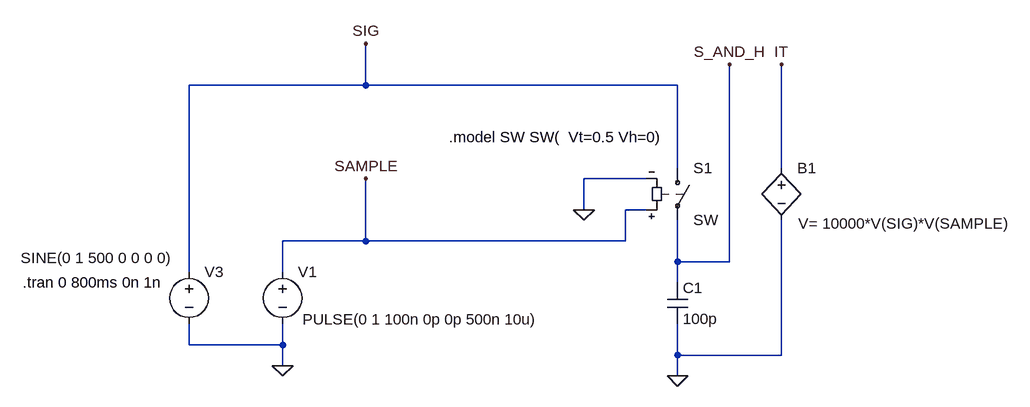
[diagram p0: schematic sampling.asc]
sampling.asc, the LTspice schematic file:
Version 4
SHEET 1 1884 680
WIRE 208 -176 208 -240
WIRE 208 -176 -64 -176
WIRE 688 -176 208 -176
WIRE 688 -48 688 -176
WIRE 848 -48 848 -208
WIRE 640 -32 544 -32
WIRE 544 16 544 -32
WIRE 640 16 608 16
WIRE 208 64 208 -32
WIRE 208 64 80 64
WIRE 608 64 608 16
WIRE 608 64 208 64
WIRE 688 96 688 32
WIRE 768 96 768 -208
WIRE 768 96 688 96
WIRE -64 112 -64 -176
WIRE 80 112 80 64
WIRE 688 128 688 96
WIRE -64 224 -64 192
WIRE 80 224 80 192
WIRE 80 224 -64 224
WIRE 688 240 688 192
WIRE 848 240 848 32
WIRE 848 240 688 240
WIRE 80 256 80 224
WIRE 688 272 688 240
FLAG 80 256 0
FLAG 544 16 0
FLAG 688 272 0
FLAG 208 -240 SIG
FLAG 208 -32 SAMPLE
FLAG 848 -208 IT
FLAG 768 -208 S_AND_H
SYMBOL voltage 80 96 R0
WINDOW 3 31 89 Left 2
WINDOW 123 0 0 Left 2
WINDOW 39 0 0 Left 2
SYMATTR Value PULSE(0 1 100n 0p 0p 500n 10u)
SYMATTR InstName V1
SYMBOL voltage -64 96 R0
WINDOW 3 -259 -6 Left 2
WINDOW 123 0 0 Left 2
WINDOW 39 0 0 Left 2
SYMATTR Value SINE(0 1 500 0 0 0 0)
SYMATTR InstName V3
SYMBOL sw 688 -64 R0
SYMATTR InstName S1
SYMBOL cap 672 128 R0
SYMATTR InstName C1
SYMATTR Value 100p
SYMBOL bv 848 -64 R0
WINDOW 3 26 101 Left 2
SYMATTR Value V= 10000*V(SIG)*V(SAMPLE)
SYMATTR InstName B1
TEXT -320 128 Left 2 !.tran 0 800ms 0n 1n
TEXT 336 -96 Left 2 !.model SW SW(  Vt=0.5 Vh=0)

The netlist it stands for:
* sampling.asc
V1 SAMPLE 0 PULSE(0 1 100n 0p 0p 500n 10u)
V3 SIG 0 SINE(0 1 500 0 0 0 0)
S1 SIG S_AND_H SAMPLE 0 SW
C1 S_AND_H 0 100p
B1 IT 0 V= 10000*V(SIG)*V(SAMPLE)
.tran 0 800ms 0n 1n
.model SW SW(  Vt=0.5 Vh=0)
.backanno
.end